# Altium schematic sheet CW342_FPGAIO_3.SchDoc: <Enter Sheet Title>
size Letter; Organization: NewAE Technology Inc.; Address1: 1083 Queen St., Suite 196; Address2: Halifax; Address3: NS; Address4: Canada B3H 0B2; SheetNumber: 5; SheetTotal: 9; SheetApproved: NO
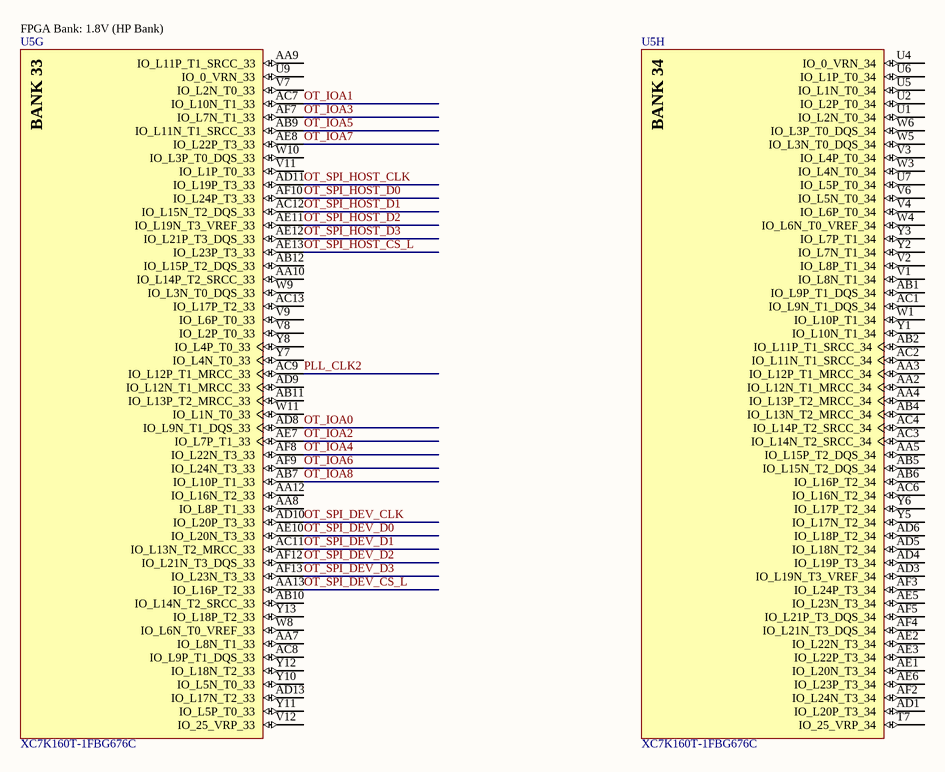
[diagram p0: CW342_FPGAIO_3.SchDoc]

## Parts
U5  XC7K160T-1FBG676C  [FBG676]  (parts G,H of 14)

## Nets
OT_IOA0: U5.AD8(IO_L9N_T1_DQS_33)
OT_IOA1: U5.AC7(IO_L10N_T1_33)
OT_IOA2: U5.AE7(IO_L7P_T1_33)
OT_IOA3: U5.AF7(IO_L7N_T1_33)
OT_IOA4: U5.AF8(IO_L22N_T3_33)
OT_IOA5: U5.AB9(IO_L11N_T1_SRCC_33)
OT_IOA6: U5.AF9(IO_L24N_T3_33)
OT_IOA7: U5.AE8(IO_L22P_T3_33)
OT_IOA8: U5.AB7(IO_L10P_T1_33)
OT_SPI_DEV_CLK: U5.AD10(IO_L20P_T3_33)
OT_SPI_DEV_CS_L: U5.AA13(IO_L16P_T2_33)
OT_SPI_DEV_D0: U5.AE10(IO_L20N_T3_33)
OT_SPI_DEV_D1: U5.AC11(IO_L13N_T2_MRCC_33)
OT_SPI_DEV_D2: U5.AF12(IO_L21N_T3_DQS_33)
OT_SPI_DEV_D3: U5.AF13(IO_L23N_T3_33)
OT_SPI_HOST_CLK: U5.AD11(IO_L19P_T3_33)
OT_SPI_HOST_CS_L: U5.AE13(IO_L23P_T3_33)
OT_SPI_HOST_D0: U5.AF10(IO_L24P_T3_33)
OT_SPI_HOST_D1: U5.AC12(IO_L15N_T2_DQS_33)
OT_SPI_HOST_D2: U5.AE11(IO_L19N_T3_VREF_33)
OT_SPI_HOST_D3: U5.AE12(IO_L21P_T3_DQS_33)
PLL_CLK2: U5.AC9(IO_L12P_T1_MRCC_33)

Not connected (* = marked no-connect by the designer): U5 AA2(IO_L12N_T1_MRCC_34) AA3(IO_L12P_T1_MRCC_34) AA4(IO_L13P_T2_MRCC_34) AA5(IO_L15P_T2_DQS_34) AA7(IO_L8N_T1_33) AA8(IO_L8P_T1_33) AA9(IO_L11P_T1_SRCC_33) AA10(IO_L14P_T2_SRCC_33) AA12(IO_L16N_T2_33) AB1(IO_L9P_T1_DQS_34) AB2(IO_L11P_T1_SRCC_34) AB4(IO_L13N_T2_MRCC_34) AB5(IO_L15N_T2_DQS_34) AB6(IO_L16P_T2_34) AB10(IO_L14N_T2_SRCC_33) AB11(IO_L13P_T2_MRCC_33) AB12(IO_L15P_T2_DQS_33) AC1(IO_L9N_T1_DQS_34) AC2(IO_L11N_T1_SRCC_34) AC3(IO_L14N_T2_SRCC_34) AC4(IO_L14P_T2_SRCC_34) AC6(IO_L16N_T2_34) AC8(IO_L9P_T1_DQS_33) AC13(IO_L17P_T2_33) AD1(IO_L20P_T3_34) AD3(IO_L19N_T3_VREF_34) AD4(IO_L19P_T3_34) AD5(IO_L18N_T2_34) AD6(IO_L18P_T2_34) AD9(IO_L12N_T1_MRCC_33) AD13(IO_L17N_T2_33) AE1(IO_L20N_T3_34) AE2(IO_L22N_T3_34) AE3(IO_L22P_T3_34) AE5(IO_L23N_T3_34) AE6(IO_L23P_T3_34) AF2(IO_L24N_T3_34) AF3(IO_L24P_T3_34) AF4(IO_L21N_T3_DQS_34) AF5(IO_L21P_T3_DQS_34) T7(IO_25_VRP_34) U1(IO_L2N_T0_34) U2(IO_L2P_T0_34) U4(IO_0_VRN_34) U5(IO_L1N_T0_34) U6(IO_L1P_T0_34) U7(IO_L5P_T0_34) U9(IO_0_VRN_33) V1(IO_L8N_T1_34) V2(IO_L8P_T1_34) V3(IO_L4P_T0_34) V4(IO_L6P_T0_34) V6(IO_L5N_T0_34) V7(IO_L2N_T0_33) V8(IO_L2P_T0_33) V9(IO_L6P_T0_33) V11(IO_L1P_T0_33) V12(IO_25_VRP_33) W1(IO_L10P_T1_34) W3(IO_L4N_T0_34) W4(IO_L6N_T0_VREF_34) W5(IO_L3N_T0_DQS_34) W6(IO_L3P_T0_DQS_34) W8(IO_L6N_T0_VREF_33) W9(IO_L3N_T0_DQS_33) W10(IO_L3P_T0_DQS_33) W11(IO_L1N_T0_33) Y1(IO_L10N_T1_34) Y2(IO_L7N_T1_34) Y3(IO_L7P_T1_34) Y5(IO_L17N_T2_34) Y6(IO_L17P_T2_34) Y7(IO_L4N_T0_33) Y8(IO_L4P_T0_33) Y10(IO_L5N_T0_33) Y11(IO_L5P_T0_33) Y12(IO_L18N_T2_33) Y13(IO_L18P_T2_33)

## Notes on the sheet
- (near U5) FPGA Bank: 1.8V (HP Bank)
- Title:
- Date:
- Rev:
- Time:
- Project:
- Sheet
- of
- License:
- Copyright © NewAE Technology Inc.
- Approved:
- NewAE.com
- File:
- (in symbol CMP-0361-00025-2, part G) BANK 33
- (in symbol CMP-0361-00025-2, part H) BANK 34

## Library data of the parts
U5 = CMP-0361-00025-2: Kintex-7 FPGA, 400 User I/Os, 8 GTX, 676-Ball BGA, Speed Grade 1, Commercial Grade, Pb-Free; Manufacturer: Xilinx; SelectIO HR: 250; GTX: 8; SelectIO HP: 150; Speed Grade: -1; RoHS: Pb-Free; PackageReference: FBG676; Code_JEDEC: MS-034; Mounting Technology: Surface Mount; ComponentLink1URL: http://www.xilinx.com/support/documentation/data_sheets/ds180_7Series_Overview.pdf; DatasheetVersion: v1.12; Generic Part Number: XC7K160T; PartNumber: XC7K160T-1FBG676C; PackageVersion: Rev 1.8; ComponentLink2URL: http://www.xilinx.com/support/documentation/user_guides/ug475_7Series_Pkg_Pinout.pdf; PackageDescription: Flip-Chip Lidless BGA, Body 27 x 27 mm, 1.0 mm Pitch; ComponentLink1Description: Datasheet; ComponentLink2Description: Package Specification